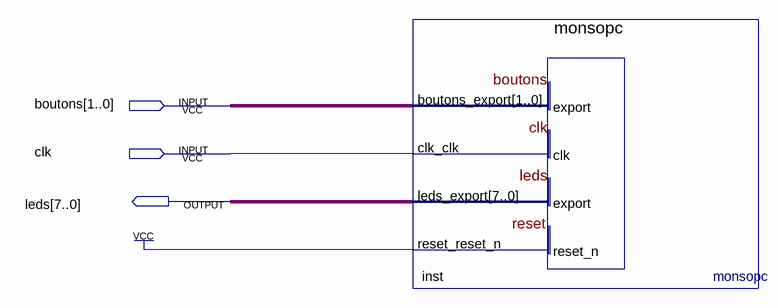
[diagram p0: schematic sheet]
// Quartus schematic sopc_compteur.bdf as structural Verilog: 1 symbols, 3 pins
module sopc_compteur (
  input  [1:0] boutons,
  input  clk,
  output [7:0] leds
);

  monsopc inst (.boutons_export(boutons), .clk_clk(clk), .reset_reset_n(1'b1), .leds_export(leds));
endmodule
